# Altium schematic sheet Master-MCU.SchDoc
size A
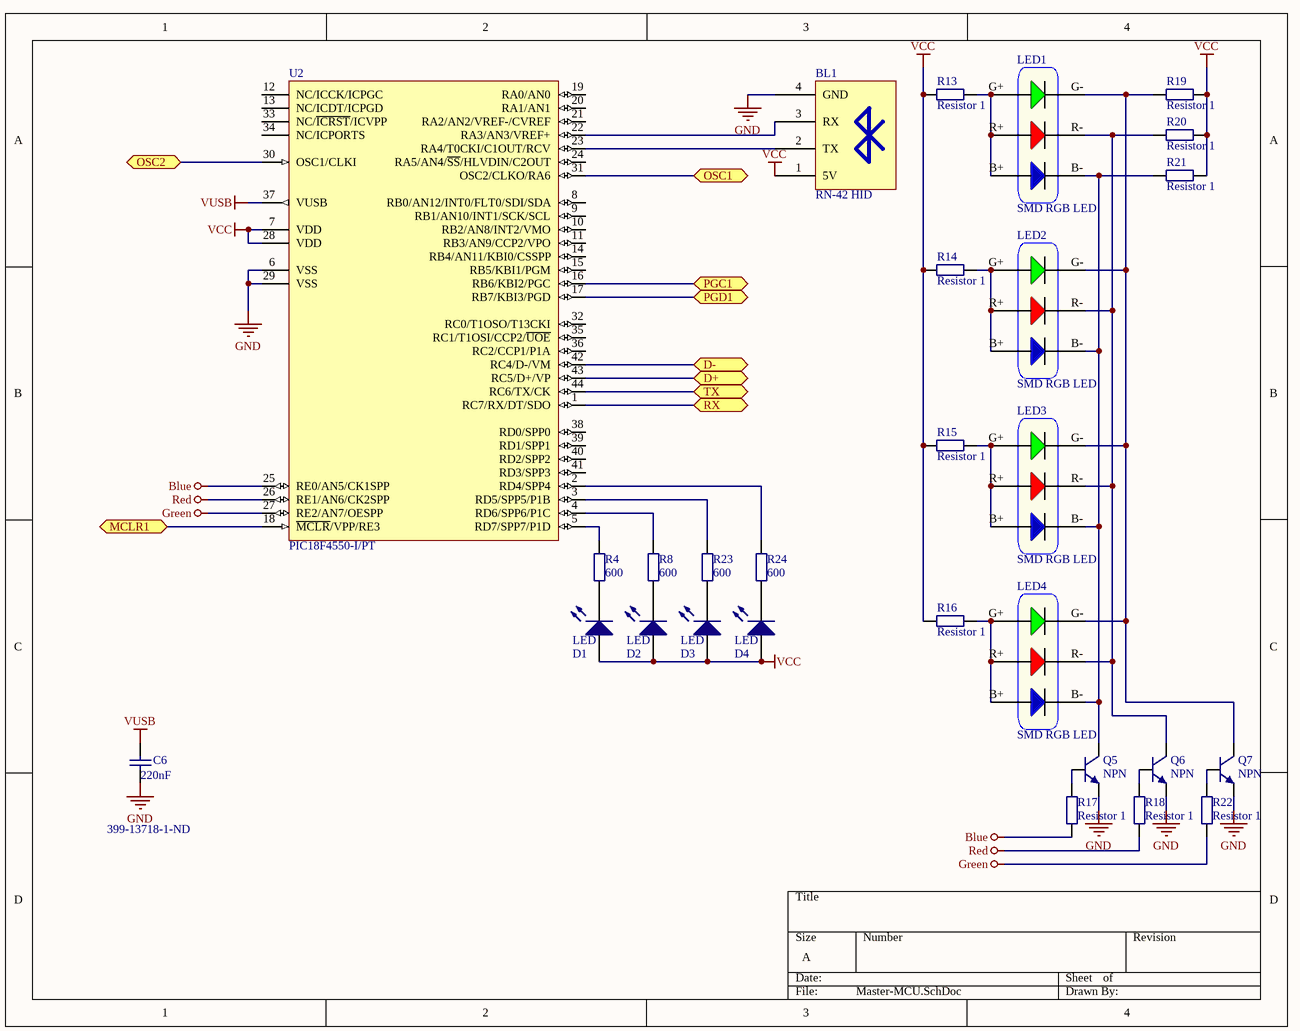
[diagram p0: Master-MCU.SchDoc]

## Parts
BL1  RN-42 HID  [Bluetooth module for PCB mounting]
C6  220nF  Supplier Part Number 1: 399-13718-1-ND  [C-0603]
D1  LED  [LED-SMD-R]
D2  LED  [LED-SMD-R]
D3  LED  [LED-SMD-R]
D4  LED  [LED-SMD-R]
LED1  SMD RGB LED  [SMD LED]
LED2  SMD RGB LED  [SMD LED]
LED3  SMD RGB LED  [SMD LED]
LED4  SMD RGB LED  [SMD LED]
Q5  NPN  [SOT95P237X111-3M-JV]
Q6  NPN  [SOT95P237X111-3M-JV]
Q7  NPN  [SOT95P237X111-3M-JV]
R4  600  [R-0603-3D]
R8  600  [R-0603-3D]
R13  Resistor 1  [R-0603-3D]
R14  Resistor 1  [R-0603-3D]
R15  Resistor 1  [R-0603-3D]
R16  Resistor 1  [R-0603-3D]
R17  Resistor 1  [R-0603-3D]
R18  Resistor 1  [R-0603-3D]
R19  Resistor 1  [R-0603-3D]
R20  Resistor 1  [R-0603-3D]
R21  Resistor 1  [R-0603-3D]
R22  Resistor 1  [R-0603-3D]
R23  600  [R-0603-3D]
R24  600  [R-0603-3D]
U2  PIC18F4550-I/PT  [TQFP-44_JV]

## Ports
D+, D-, MCLR1, OSC1, OSC2, PGC1, PGD1, RX, TX

## Nets
Blue: R17.1 U2.25(RE0/AN5/CK1SPP)
GND: BL1.4(GND) C6.1 Q5.1(E) Q6.1(E) Q7.1(E) U2.6(VSS) U2.29(VSS)
Green: R22.1 U2.27(RE2/AN7/OESPP)
Red: R18.1 U2.26(RE1/AN6/CK2SPP)
VCC: BL1.1(5V) D1.1(A) D2.1(A) D3.1(A) D4.1(A) R13.1 R14.1 R15.1 R16.1 R19.1 R20.1 R21.1 U2.7(VDD) U2.28(VDD)
VUSB: C6.2 U2.37(VUSB)
D+: U2.43(RC5/D+/VP) ; port D+
D-: U2.42(RC4/D-/VM) ; port D-
MCLR1: U2.18(~{MCLR}/VPP/RE3) ; port MCLR1
OSC1: U2.31(OSC2/CLKO/RA6) ; port OSC1
OSC2: U2.30(OSC1/CLKI) ; port OSC2
PGC1: U2.16(RB6/KBI2/PGC) ; port PGC1
PGD1: U2.17(RB7/KBI3/PGD) ; port PGD1
RX: U2.1(RC7/RX/DT/SDO) ; port RX
TX: U2.44(RC6/TX/CK) ; port TX
NetBL1_2: BL1.2(TX) U2.23(RA4/T0CKI/C1OUT/RCV)
NetBL1_3: BL1.3(RX) U2.22(RA3/AN3/VREF+)
NetD1_2: D1.2(K) R4.2
NetD2_2: D2.2(K) R8.2
NetD3_2: D3.2(K) R23.2
NetD4_2: D4.2(K) R24.2
NetLED1_B+: LED1.B+ LED1.G+ LED1.R+ R13.2
NetLED1_B-: LED1.B- LED2.B- LED3.B- LED4.B- Q5.3(C) R21.2
NetLED1_G-: LED1.G- LED2.G- LED3.G- LED4.G- Q7.3(C) R19.2
NetLED1_R-: LED1.R- LED2.R- LED3.R- LED4.R- Q6.3(C) R20.2
NetLED2_B+: LED2.B+ LED2.G+ LED2.R+ R14.2
NetLED3_B+: LED3.B+ LED3.G+ LED3.R+ R15.2
NetLED4_B+: LED4.B+ LED4.G+ LED4.R+ R16.2
NetQ5_2: Q5.2(B) R17.2
NetQ6_2: Q6.2(B) R18.2
NetQ7_2: Q7.2(B) R22.2
NetR4_1: R4.1 U2.5(RD7/SPP7/P1D)
NetR8_1: R8.1 U2.4(RD6/SPP6/P1C)
NetR23_1: R23.1 U2.3(RD5/SPP5/P1B)
NetR24_1: R24.1 U2.2(RD4/SPP4)

Not connected (* = marked no-connect by the designer): U2 8(RB0/AN12/INT0/FLT0/SDI/SDA) 9(RB1/AN10/INT1/SCK/SCL) 10(RB2/AN8/INT2/VMO) 11(RB3/AN9/CCP2/VPO) 12(NC/ICCK/ICPGC) 13(NC/ICDT/ICPGD) 14(RB4/AN11/KBI0/CSSPP) 15(RB5/KBI1/PGM) 19(RA0/AN0) 20(RA1/AN1) 21(RA2/AN2/VREF-/CVREF) 24(RA5/AN4/~{SS}/HLVDIN/C2OUT) 32(RC0/T1OSO/T13CKI) 33(NC/~{ICRST}/ICVPP) 34(NC/ICPORTS) 35(RC1/T1OSI/CCP2/~{UOE}) 36(RC2/CCP1/P1A) 38(RD0/SPP0) 39(RD1/SPP1) 40(RD2/SPP2) 41(RD3/SPP3)

## Library data of the parts
BL1 = Bluetooth module for PCB mounting
C6 = Capacitor 1: Capacitor; Value: 100pF; Supplier 1: Digi-Key
D1-D4 = LED: Typical LED; Published: 8-Jun-2000; LatestRevisionDate: 17-Jul-2002; LatestRevisionNote: Re-released for DXP Platform.; PackageVersion: Feb-2002; PackageReference: 3.2X1.6X1.1; Publisher: Altium Limited
LED1-LED4 = LED: https://www.tweaking4all.com/wp-content/uploads/2014/01/5050LED.pdf
Q5-Q7 = Transistor NPN: NPN General Purpose Amplifier; Published: 8-Jun-2000; LatestRevisionDate: 15-Jan-2003; LatestRevisionNote: PCB Footprint 'BCY-W3/D4.7' replaced; DatasheetVersion: 1997; PackageVersion: Sep-1998; PackageReference: TO-92A; Publisher: Altium Limited; Code_JEDEC: TO-92A; ComponentLink1Description: Manufacturer Link; ComponentLink1URL: http://www.fairchildsemi.com/; ComponentLink2Description: Datasheet; ComponentLink2URL: http://www.fairchildsemi.com/ds/2N%2F2N3904.pdf
R4 R8 R13-R24 = Resistor 1: Resistor; Value: 1K
U2 = PIC18F4550-I/PT: High Performance, Enhanced Flash, USB Microcontroller with nanoWatt Technology, 32K Flash, 44-Pin TQFP, Industrial Temperature Range; Published: 29-Jan-2009; LatestRevisionDate: 02-Dec-2009; LatestRevisionNote: Updated to datasheet revision E, Aug-2008; DatasheetVersion: revE, Aug-2008; PackageVersion: revBB, Aug-2009; PackageReference: TQFP-PT44; Publisher: Altium Limited; PackageDescription: 44-Lead Plastic Thin Quad Flatpack (PT) - 10x10x1mm Body, 2.00mm [TQFP]; Supplier 1: Digi-Key; Supplier Part Number 1: PIC18F4550-I/PT-ND; Supplier 2: Farnell; Supplier Part Number 2: 9321365; Supplier 3: Farnell; Supplier Part Number 3: 1528447; Code_JEDEC: MS-026; ComponentLink1Description: Datasheet; ComponentLink1URL: http://ww1.microchip.com/downloads/en/DeviceDoc/39632e.pdf; ComponentLink2Description: Packaging Specification; ComponentLink2URL: http://www.microchip.com/stellent/groups/techpub_sg/documents/packagingspec/en012702.pdf; ComponentLink3Description: Microchip.com Home; ComponentLink3URL: http://www.microchip.com/